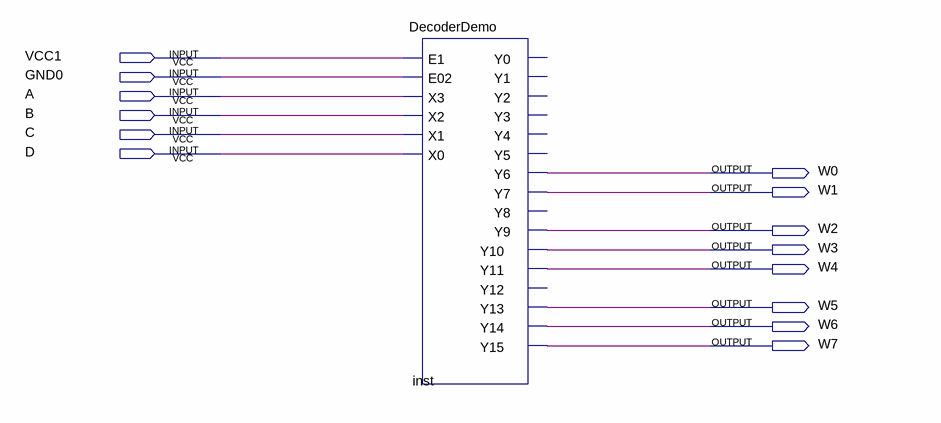
[diagram p0: schematic sheet]
// Quartus schematic DecoderDemo2.bdf as structural Verilog: 1 symbols, 14 pins
module DecoderDemo2 (
  input  VCC1,
  input  GND0,
  input  A,
  input  B,
  input  C,
  input  D,
  output W0,
  output W1,
  output W2,
  output W3,
  output W4,
  output W5,
  output W6,
  output W7
);

  DecoderDemo inst (
    .E1(VCC1), .E02(GND0), .X3(A), .X2(B), .X1(C), .X0(D), .Y6(W0), .Y7(W1), .Y9(W2), .Y10(W3), .Y11(W4),
    .Y13(W5), .Y14(W6), .Y15(W7));  // open: Y0, Y1, Y2, Y3, Y4, Y5, Y8, Y12
endmodule
